# EAGLE design xmc (EAGLE 9.1.0)
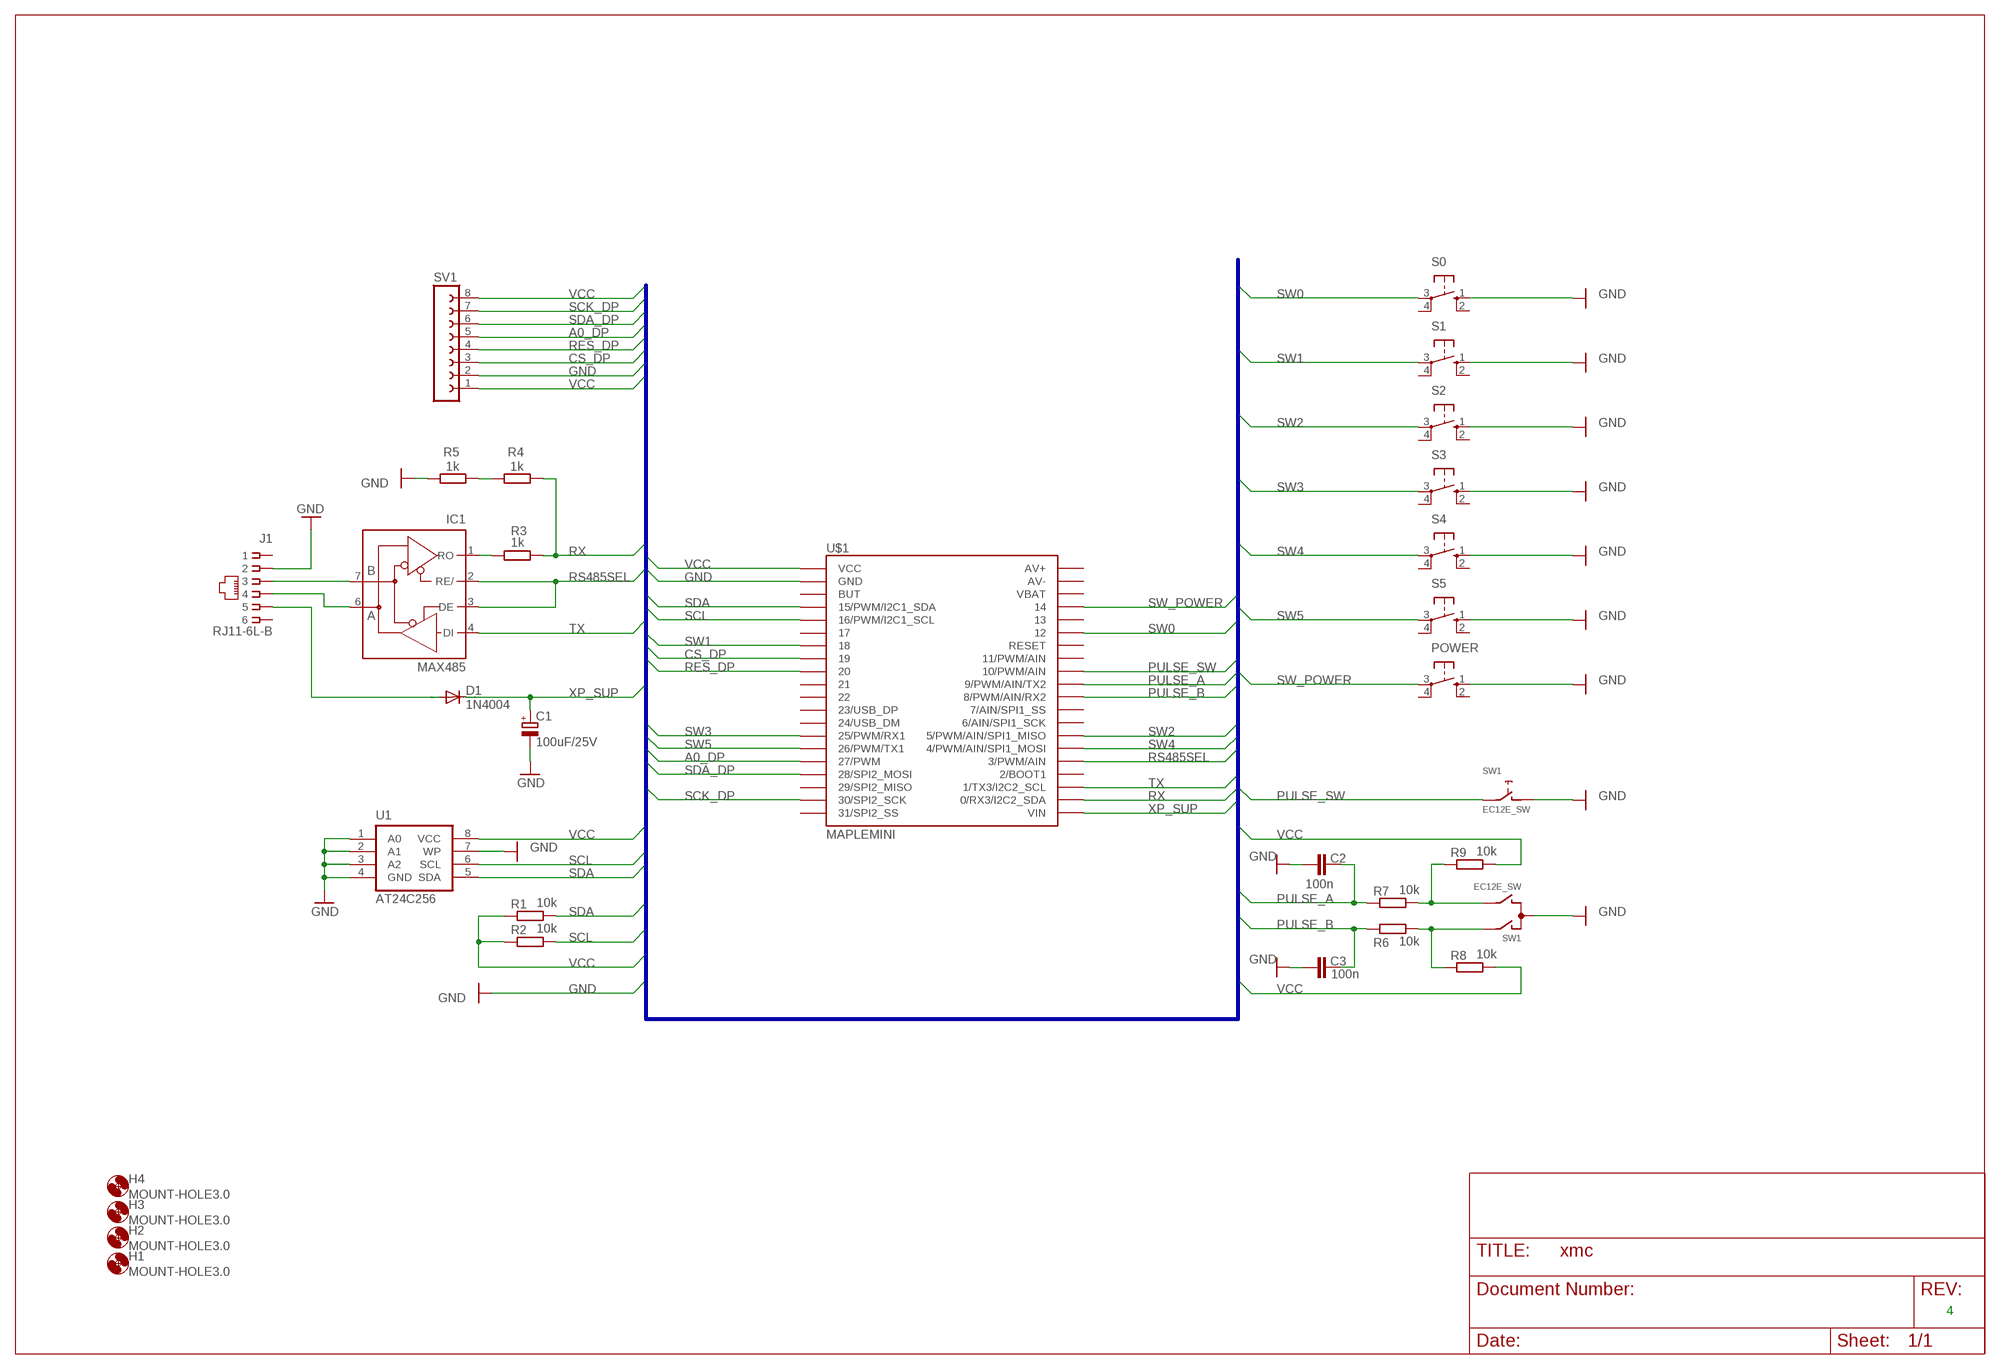
[diagram p0: schematic, sheet 1]

## Parts
C1  100uF/25V  CPOL-EUE2.5-6  [E2,5-6]
C2  100n  C-EU025-024X044  [C025-024X044]
C3  100n  C-EU025-024X044  [C025-024X044]
D1  1N4004  [DO41-10]
H1  MOUNT-HOLE3.0  [3,0]
H2  MOUNT-HOLE3.0  [3,0]
H3  MOUNT-HOLE3.0  [3,0]
H4  MOUNT-HOLE3.0  [3,0]
IC1  MAX485  MAX481CSA  [SO08]
J1  RJ11-6L-B  [RJ11-NO_SHIELD]
POWER  10-XX  [B3F-10XX]
R1  10k  R-EU_0207/7  [0207/7]
R2  10k  R-EU_0207/7  [0207/7]
R3  1k  R-EU_0207/7  [0207/7]
R4  1k  R-EU_0207/7  [0207/7]
R5  1k  R-EU_0207/7  [0207/7]
R6  10k  R-EU_0207/7  [0207/7]
R7  10k  R-EU_0207/7  [0207/7]
R8  10k  R-EU_0207/7  [0207/7]
R9  10k  R-EU_0207/7  [0207/7]
S0  10-XX  [B3F-10XX]
S1  10-XX  [B3F-10XX]
S2  10-XX  [B3F-10XX]
S3  10-XX  [B3F-10XX]
S4  10-XX  [B3F-10XX]
S5  10-XX  [B3F-10XX]
SV1  FE08-1  [FE08]
SW1  EC12E_SW  [ALPS_EC12E_SW]
U1  AT24C256  AT24CXX  [SO08-8S1]
U$1  MAPLEMINI  [20-DIP]

## Nets
A0_DP: SV1.5 U$1.16(27/PWM)
CS_DP: SV1.3 U$1.8
GND: C1.- C2.2 C3.2 J1.2 POWER.1(S) R5.2 S0.1(S) S1.1(S) S2.1(S) S3.1(S) S4.1(S) S5.1(S) SV1.2 SW1.C SW1.D U1.1(A0) U1.2(A1) U1.3(A2) U1.4(GND) U1.7(WP) U$1.2(GND)
N$1: R7.2 R9.1 SW1.B
N$2: R6.2 R8.1 SW1.A
N$3: D1.A J1.5
N$4: IC1.1(RO) R3.1
N$5: R4.2 R5.1
N$6: IC1.7(B) J1.3
N$7: IC1.6(A) J1.4
PULSE_A: C2.1 R7.1 U$1.31(9/PWM/AIN/TX2)
PULSE_B: C3.1 R6.1 U$1.30(8/PWM/AIN/RX2)
PULSE_SW: SW1.E U$1.32(10/PWM/AIN)
RES_DP: SV1.4 U$1.9
RS485SEL: IC1.2(RE/) IC1.3(DE) U$1.25(3/PWM/AIN)
RX: R3.2 R4.1 U$1.22(0/RX3/I2C2_SDA)
SCK_DP: SV1.7 U$1.19(30/SPI2_SCK)
SCL: R2.2 U1.6(SCL) U$1.5(16/PWM/I2C1_SCL)
SDA: R1.2 U1.5(SDA) U$1.4(15/PWM/I2C1_SDA)
SDA_DP: SV1.6 U$1.17(28/SPI2_MOSI)
SW0: S0.3(P) U$1.35
SW1: S1.3(P) U$1.7
SW2: S2.3(P) U$1.27(5/PWM/AIN/SPI1_MISO)
SW3: S3.3(P) U$1.14(25/PWM/RX1)
SW4: S4.3(P) U$1.26(4/PWM/AIN/SPI1_MOSI)
SW5: S5.3(P) U$1.15(26/PWM/TX1)
SW_POWER: POWER.3(P) U$1.37
TX: IC1.4(DI) U$1.23(1/TX3/I2C2_SCL)
VCC: R1.1 R2.1 R8.2 R9.2 SV1.1 SV1.8 U1.8(VCC) U$1.1(VCC)
XP_SUP: C1.+ D1.C U$1.21(VIN)
Unconnected: J1.1 J1.6 POWER.2(S1) POWER.4(P1) S0.2(S1) S0.4(P1) S1.2(S1) S1.4(P1) S2.2(S1) S2.4(P1) S3.2(S1) S3.4(P1) S4.2(S1) S4.4(P1) S5.2(S1) S5.4(P1) U$1.3(BUT) U$1.6 U$1.10 U$1.11 U$1.12(23/USB_DP) U$1.13(24/USB_DM) U$1.18(29/SPI2_MISO) U$1.20(31/SPI2_SS) U$1.24(2/BOOT1) U$1.28(6/AIN/SPI1_SCK) U$1.29(7/AIN/SPI1_SS) U$1.33(11/PWM/AIN) U$1.34(RESET) U$1.36 U$1.38(VBAT) U$1.39(AV-) U$1.40(AV+)

## Buses
VCC,GND,SW[0..5],SW_POWER,RX,TX,RS485SEL,SDA,SCL,SDA_DP,SCK_DP,RES_DP,CS_DP,A0_DP,PULSE_SW,PULSE_A,PULSE_B,XP_SUP

## Notes on the sheet
- 4

## Power pins joined to a net without a drawn wire
GND: IC1.5(GND)
VCC: IC1.8(VCC)

## Library data of the parts
C1 = rcl:CPOL-EU: POLARIZED CAPACITOR, European symbol; SPICEPREFIX: C
C2 C3 = rcl:C-EU: CAPACITOR, European symbol; SPICEPREFIX: C
D1 = diode:1N4004: DIODE general purpose rectifier, 1 A
H1-H4 = holes:MOUNT-HOLE: MOUNTING HOLE with drill center marker
IC1 = maxim:MAX481CSA: RS485 TRANSEIVER; MF: MAXIM; MPN: MAX481CSA; OC_FARNELL: unknown; OC_NEWARK: 90C3817
J1 = con-tycoelectronics:RJ11: CORCOM Modular RJ Jacks No Shield Source: www.tycoelectronics.com .. ENG_DS_1654001_1099_RJ_L_0507.pdf; MF: TYCO ELECTRONICS; MPN: RJ11-6L-B; OC_FARNELL: unknown; OC_NEWARK: 52K3613
POWER S0 S1-S5 = switch-omron:10-XX: OMRON SWITCH; MPN: B3F-1000; OC_FARNELL: 176432; OC_NEWARK: 36M3542
R1-R9 = rcl:R-EU_: RESISTOR, European symbol; SPICEPREFIX: R
SV1 = con-lsta:FE08-1: FEMALE HEADER; OC_FARNELL: unknown; OC_NEWARK: unknown
SW1 = switch-alps_roe_1:EC12E_SW: ALPS rotary Encoder EC12E series with switch; MPN: EC12E2424407; OC_FARNELL: 1520813; OC_NEWARK: 74M1068
U1 = memory-atmel:AT24CXX: EEPROM SPI bus serial
U$1 = maplemini:MAPLEMINI

## Board
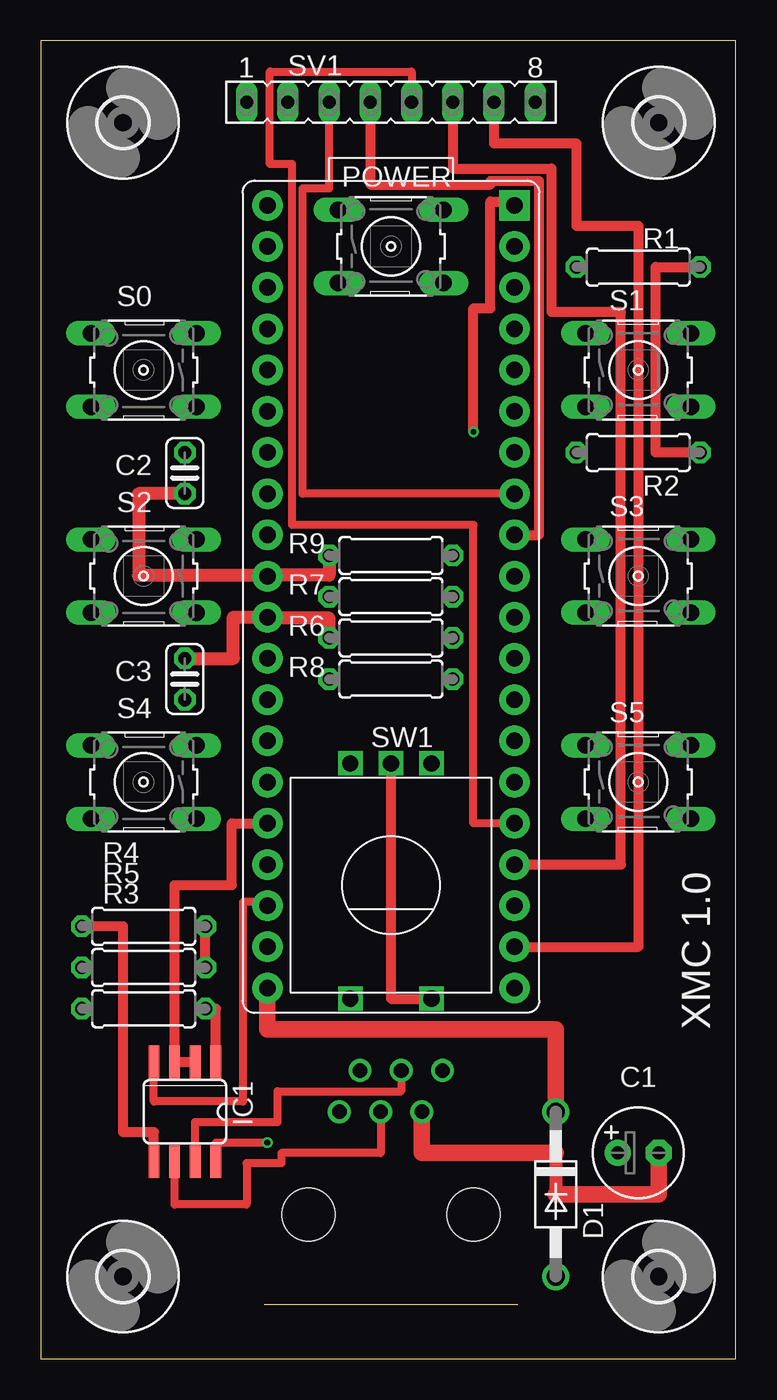
[diagram p1: board, top side]
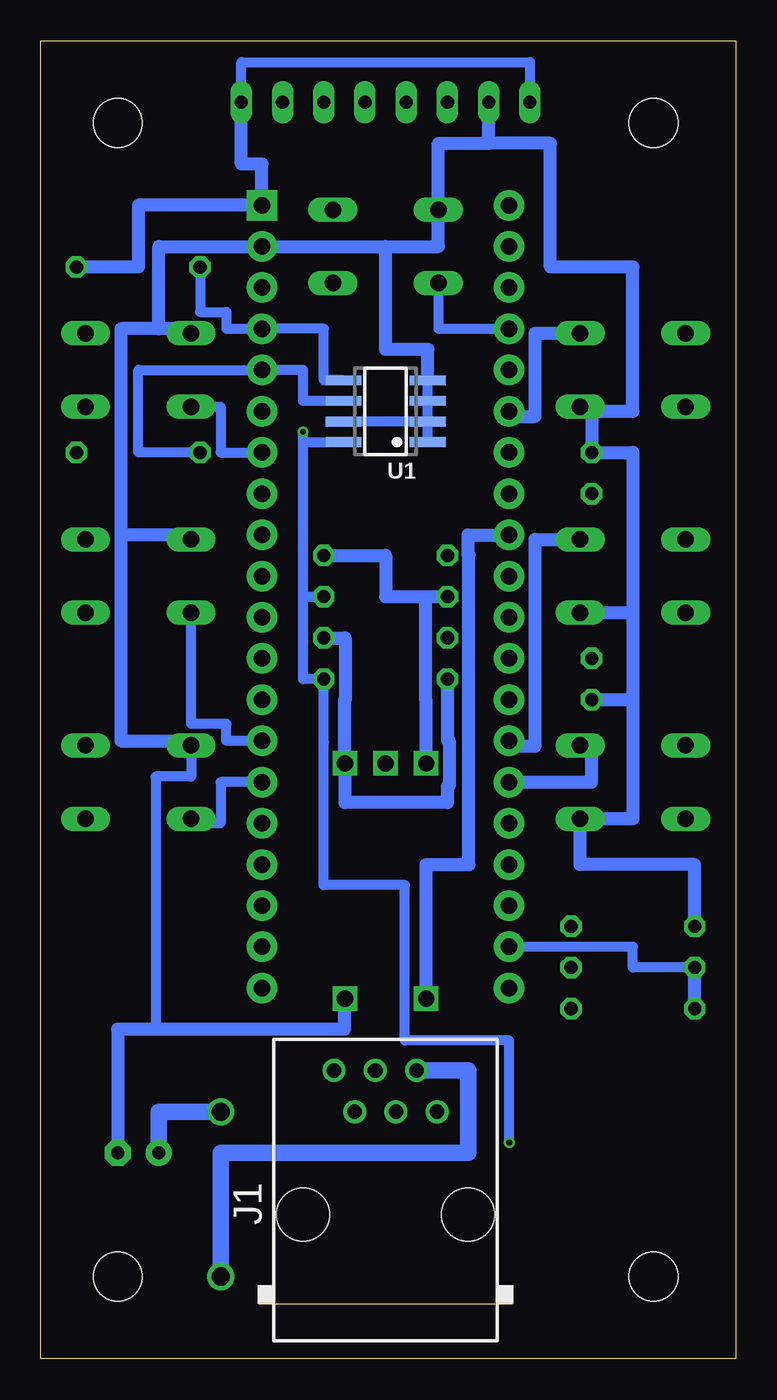
[diagram p2: board, bottom side, seen from below]

Size 42.85 x 81.27 mm. Coordinates in mm from the lower left corner, seen from the top.
Outline: 0,0 42.85,0 42.85,81.27 0,81.27 0,0
Copper layers (1*16): Top 0.035mm / dielectric 1.5mm / Bottom 0.035mm
Design rules "SeeedStudio_2layer_DRU_no_angle_20140221": minimum track width 6mil, minimum drill 12mil, track to track 6mil, track to pad 6mil, pad to pad 6mil, via to via 6mil, smd to smd 0mil, copper to edge 10mil, drill to drill 10mil, minimum pad ring 10mil, minimum via ring 6mil, stop-mask expansion 2mil, vias tented up to drill 100mil, thermal gap 10mil

### Footprints (pad centres in the part's own frame; a part is rotated, then mirrored left to right if it is on the bottom)
E2,5-6 = drill 0.813 pad 1.6: + -1.27,0 | drill 0.813 pad 1.6 octagon: - 1.27,0
C025-024X044 = drill 0.813 octagon: 1 -1.27,0; 2 1.27,0
DO41-10 = drill 1.118: A 5.08,0; C -5.08,0
3,0 = hole 3: 0,0
SO08 = smd 0.66 x 2.032: 1 -1.905,-3.073; 2 -0.635,-3.073; 3 0.635,-3.073; 4 1.905,-3.073; 5 1.905,3.073; 6 0.635,3.073; 7 -0.635,3.073; 8 -1.905,3.073
RJ11-NO_SHIELD = drill 0.9 pad 1.4: 1 -3.175,8.89; 2 -1.905,6.35; 3 -0.635,8.89; 4 0.635,6.35; 5 1.905,8.89; 6 3.175,6.35 | hole 3.251: -5.08,0; 5.08,0
B3F-10XX = drill 1.016 long: 1 -3.251,2.261; 2 3.251,2.261; 3 -3.251,-2.261; 4 3.251,-2.261
0207/7 = drill 0.813 octagon: 1 -3.81,0; 2 3.81,0
FE08 = drill 0.813 long: 1 -8.89,0; 2 -6.35,0; 3 -3.81,0; 4 -1.27,0; 5 1.27,0; 6 3.81,0; 7 6.35,0; 8 8.89,0
ALPS_EC12E_SW = drill 1 square: A -2.5,-7.5; B 2.5,-7.5; C 0,-7.5; D -2.5,7; E 2.5,7
SO08-8S1 = smd 0.6 x 2.2: 1 -1.905,-2.6; 2 -0.635,-2.6; 3 0.635,-2.6; 4 1.905,-2.6; 5 1.905,2.6; 6 0.635,2.6; 7 -0.635,2.6; 8 -1.905,2.6
20-DIP = drill 1.016 pad 1.88 square: 1 -24.13,-7.62 | drill 1.016 pad 1.88: 2 -21.59,-7.62; 3 -19.05,-7.62; 4 -16.51,-7.62; 5 -13.97,-7.62; 6 -11.43,-7.62; 7 -8.89,-7.62; 8 -6.35,-7.62; 9 -3.81,-7.62; 10 -1.27,-7.62; 11 1.27,-7.62; 12 3.81,-7.62; 13 6.35,-7.62; 14 8.89,-7.62; 15 11.43,-7.62; 16 13.97,-7.62; 17 16.51,-7.62; 18 19.05,-7.62; 19 21.59,-7.62; 20 24.13,-7.62; 21 24.13,7.62; 22 21.59,7.62; 23 19.05,7.62; 24 16.51,7.62; 25 13.97,7.62; 26 11.43,7.62; 27 8.89,7.62; 28 6.35,7.62; 29 3.81,7.62; 30 1.27,7.62; 31 -1.27,7.62; 32 -3.81,7.62; 33 -6.35,7.62; 34 -8.89,7.62; 35 -11.43,7.62; 36 -13.97,7.62; 37 -16.51,7.62; 38 -19.05,7.62; 39 -21.59,7.62; 40 -24.13,7.62

### Placement (x,y rotation side)
C1  36.83,12.7 0 top
C2  8.89,54.61 90 top
C3  8.89,41.91 270 top
D1  31.75,10.16 270 top
H1  38.1,5.08 0 top
H2  38.1,76.2 0 top
H3  5.08,76.2 0 top
H4  5.08,5.08 0 top
IC1  8.89,15.24 180 top
J1  21.59,8.89 0 bottom
POWER  21.59,68.58 0 top
R1  36.83,67.31 180 top
R2  36.83,55.88 180 top
R3  6.35,21.59 180 top
R4  6.35,24.13 0 top
R5  6.35,26.67 180 top
R6  21.59,44.45 0 top
R7  21.59,49.53 0 top
R8  21.59,41.91 0 top
R9  21.59,46.99 0 top
S0  6.35,60.96 180 top
S1  36.83,60.96 0 top
S2  6.35,48.26 180 top
S3  36.83,48.26 0 top
S4  6.35,35.56 180 top
S5  36.83,35.56 0 top
SV1  21.59,77.47 0 top
SW1  21.59,29.21 180 top
U1  21.59,58.42 90 bottom
U$1  21.59,46.99 270 bottom

### Tracks (layer width: path | path; a pad name or v marks a point on that pad's centre or on a via)
A0_DP
  Top 0.508: U$1.16 26.67,33.02 26.67,51.41 15.49,51.41 15.49,73.66 14.12,73.66 14.12,79.35 22.86,79.35 SV1.5
CS_DP
  Top 0.508: SV1.3 17.78,72.16 16.15,72.16 16.15,53.34 U$1.8
GND
  Top 0.61: SW1.D 21.59,22.21 SW1.C | IC1.5 6.99,13.97 5.08,13.97 5.08,26.67 R5.2
  Top 0.813: 31.75,12.7 31.75,10.16
  Top 1.016: J1.2 23.5,12.7 31.75,12.7 | 31.75,10.16 38.1,10.16 C1.-
  Bottom 0.61: U1.4 U1.3 U1.2 | U1.1 U1.2 | U1.2 U1.7 | 6.35,46 6.35,45.72 | S3.1 33.58,50.8 | 33.58,38.1 S5.1 33.58,35.89 35.76,35.89 35.76,20.32 35.56,20.32 | S1.1 33.58,63.5
  Bottom 0.813: SW1.D 24.13,22.17 24.13,20.32 35.56,20.32 38.1,20.32 C1.- | S2.1 6.35,46 | 6.35,40.64 6.35,45.72 6.35,55.88 C2.2 8.89,58.7 S0.1 9.6,58.42 6.35,58.42 6.35,67.31 11.43,67.31 11.43,74.93 15.24,74.93 | 6.35,40.64 6.35,33.3 S4.1 9.6,30.48 2.54,30.48 R5.2 | 33.58,50.8 37.9,50.8 | 37.9,50.8 37.9,63.5 35.56,63.5 | 37.9,50.8 37.9,38.1 33.58,38.1 | 15.24,74.93 18.34,74.93 POWER.1 18.34,68.58 21.59,68.58 | 15.24,74.93 SV1.2 | 21.59,68.58 U$1.2 35.56,68.58 35.56,63.5 | 33.58,63.5 35.56,63.5 | U1.4 18.99,62.23 21.59,62.23 21.59,68.58 | C3.2 6.35,40.64
N$1
  Bottom 0.813: SW1.B 19.09,40.59 19.1,40.59 19.1,46.99 R9.1 21.59,46.99 21.59,49.53 R7.2
N$2
  Bottom 0.813: R8.1 17.78,38.12 17.68,38.12 17.68,35.3 17.78,35.3 17.78,34.29 24.09,34.29 SW1.A 24.13,36.71 24.13,40.59 24.08,40.59 24.08,44.45 R6.2
N$3
  Bottom 1.016: D1.A 31.75,12.7 16.51,12.7 16.51,17.78 J1.5
N$4
  Top 0.61: R3.1 10.79,21.59 IC1.1
N$5
  Top 0.61: R4.2 R5.1
N$6
  Top 0.508: J1.3 22.23,16.5 14.61,16.5 14.61,14.61 9.53,14.61 IC1.7
N$7
  Top 0.508: IC1.6 8.26,9.53 12.7,9.53 12.7,12.06 14.83,12.06 14.83,12.7 20.95,12.7 J1.4
PULSE_A
  Top 0.813: R7.1 17.78,48.31 13.97,48.31 | 13.97,48.31 U$1.31 | C2.1 6.04,53.34 6.04,48.31 13.97,48.31
PULSE_B
  Top 0.813: R6.1 17.78,45.67 13.97,45.67 U$1.30 11.89,45.72 11.89,43.18 C3.1
PULSE_SW
  Bottom 0.813: SW1.E 19.09,30.48 16.46,30.48 16.46,49.58 16.51,49.58 16.51,50.8 U$1.32
RES_DP
  Top 0.61: U$1.9 30.71,50.8 30.71,72.62 30.48,72.62 27.71,72.62 27.71,72.39 20.32,72.39 SV1.4
RS485SEL
  Top 0.61: U$1.25 11.79,33.02 11.79,29.21 8.26,29.21 IC1.3 IC1.2
RX
  Bottom 0.61: R4.1 6.35,24.13 6.35,25.4 U$1.22
  Bottom 0.813: R3.2 R4.1
SCK_DP
  Top 0.61: U$1.19 36.83,25.4 36.83,69.85 33.02,69.85 33.02,74.93 27.94,74.93 SV1.7
SCL
  Bottom 0.61: U1.6 26.67,59.05 26.67,60.96 U$1.5 36.83,60.96 36.83,55.88 R2.2
SDA
  Bottom 0.61: U1.5 25.4,60.33 25.4,63.5 U$1.4 31.39,63.5 31.39,64.54 33.02,64.54 R1.2
SDA_DP
  Top 0.61: SV1.6 25.4,73.38 31.47,73.38 31.47,64.54 35.76,64.54 35.76,30.48 U$1.17
SW0
  Bottom 0.813: S0.3 12.37,63.22 12.37,58.09 13.64,58.09 U$1.35
SW1
  Bottom 0.61: S1.3 31.75,58.7 31.75,55.88 U$1.7
SW2
  Bottom 0.813: S2.3 12.37,50.52 12.37,37.77 13.64,37.77 U$1.27
SW3
  Bottom 0.61: U$1.14 31.39,38.1 31.39,39.14 33.58,39.14 S3.3
SW4
  Bottom 0.813: U$1.26 8.89,35.56 8.89,37.82 S4.3
SW5
  Bottom 0.61: U$1.15 31.75,35.56 31.75,33.02 33.58,33.02 S5.3
SW_POWER
  Bottom 0.61: POWER.3 18.34,63.5 U$1.37
TX
  Top 0.508: IC1.4 6.99,15.88 12.47,15.88 12.47,28.17 13.74,28.17 U$1.23
VCC  (via drill 0.35)
  Top 0.508: v13.97,13.34 10.79,13.34 IC1.8
  Top 0.61: R2.1 37.9,55.88 37.9,67.31 R1.1 | v26.67,57.15 26.67,64.77 27.71,64.77 27.71,71.35 28.98,71.35 U$1.1
  Bottom 0.61: SV1.8 30.48,79.95 12.7,79.95 SV1.1 | 26.67,46.99 26.67,41.91 R8.2 25.4,38.02 25.4,29.21 20.4,29.21 20.4,19.63 13.97,19.63 v13.97,13.34 | 26.67,46.99 R9.2 | 26.67,56.52 U1.8 | 26.67,46.99 26.67,56.52 | 26.67,56.52 v26.67,57.15
  Bottom 0.813: R1.1 36.83,67.31 36.83,71.12 U$1.1 29.21,73.66 30.48,73.66 SV1.8
XP_SUP
  Top 1.016: D1.C 31.75,20.32 13.97,20.32 U$1.21
  Bottom 1.016: D1.C 35.56,15.24 C1.+

### Text on the board
tNames: XMC 1.0